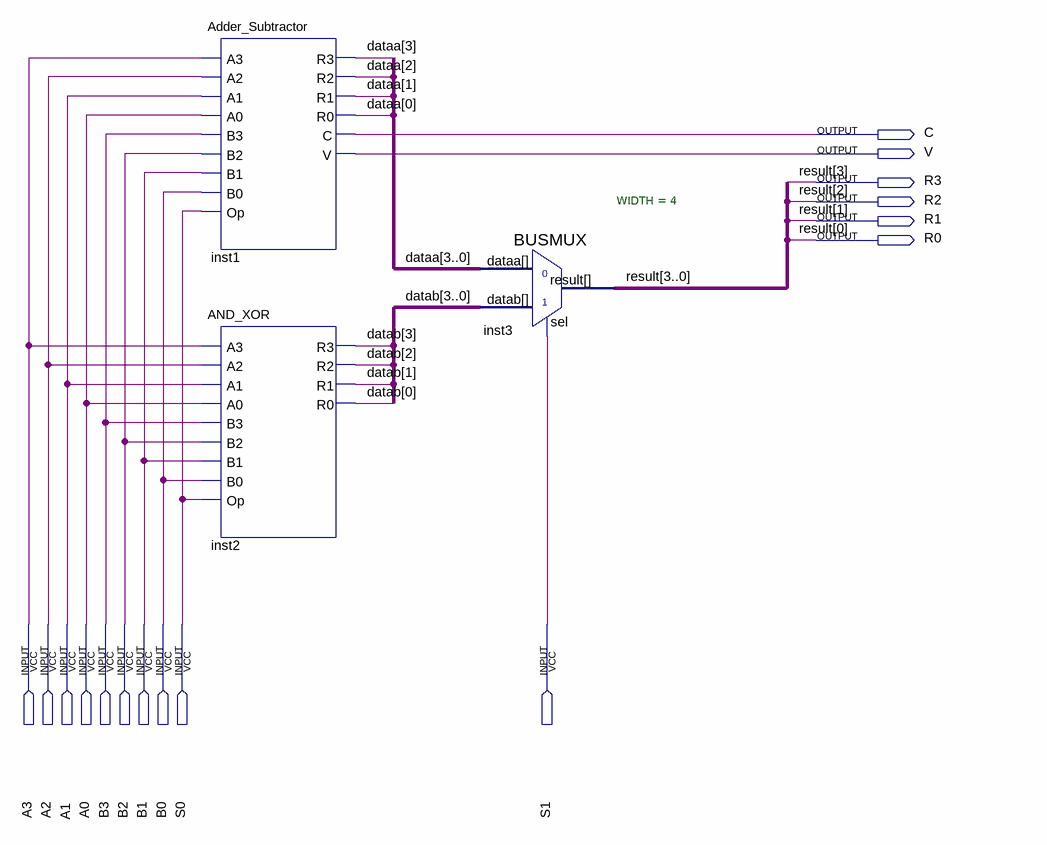
[diagram p0: schematic sheet]
// Quartus schematic ALU.bdf as structural Verilog: 3 symbols, 16 pins
module ALU (
  input  A3,
  input  A2,
  input  A1,
  input  A0,
  input  B3,
  input  B2,
  input  B1,
  input  B0,
  input  S0,
  input  S1,
  output C,
  output V,
  output R3,
  output R2,
  output R1,
  output R0
);

  wire [3:0] dataa, datab;

  Adder_Subtractor inst1 (
    .A3(A3), .A2(A2), .A1(A1), .A0(A0), .B3(B3), .B2(B2), .B1(B1), .B0(B0), .Op(S0), .R3(dataa[3]),
    .R2(dataa[2]), .R1(dataa[1]), .R0(dataa[0]), .C(C), .V(V));
  AND_XOR inst2 (
    .A3(A3), .A2(A2), .A1(A1), .A0(A0), .B3(B3), .B2(B2), .B1(B1), .B0(B0), .Op(S0), .R3(datab[3]),
    .R2(datab[2]), .R1(datab[1]), .R0(datab[0]));
  BUSMUX #(.WIDTH(4)) inst3 (.datab(datab), .sel(S1), .dataa(dataa), .result({R3, R2, R1, R0}));

  // Other names for the same wires on the sheet: result[3:0] = {R3, R2, R1, R0}
endmodule
